# Altium schematic sheet AUDIO.SchDoc
size A4
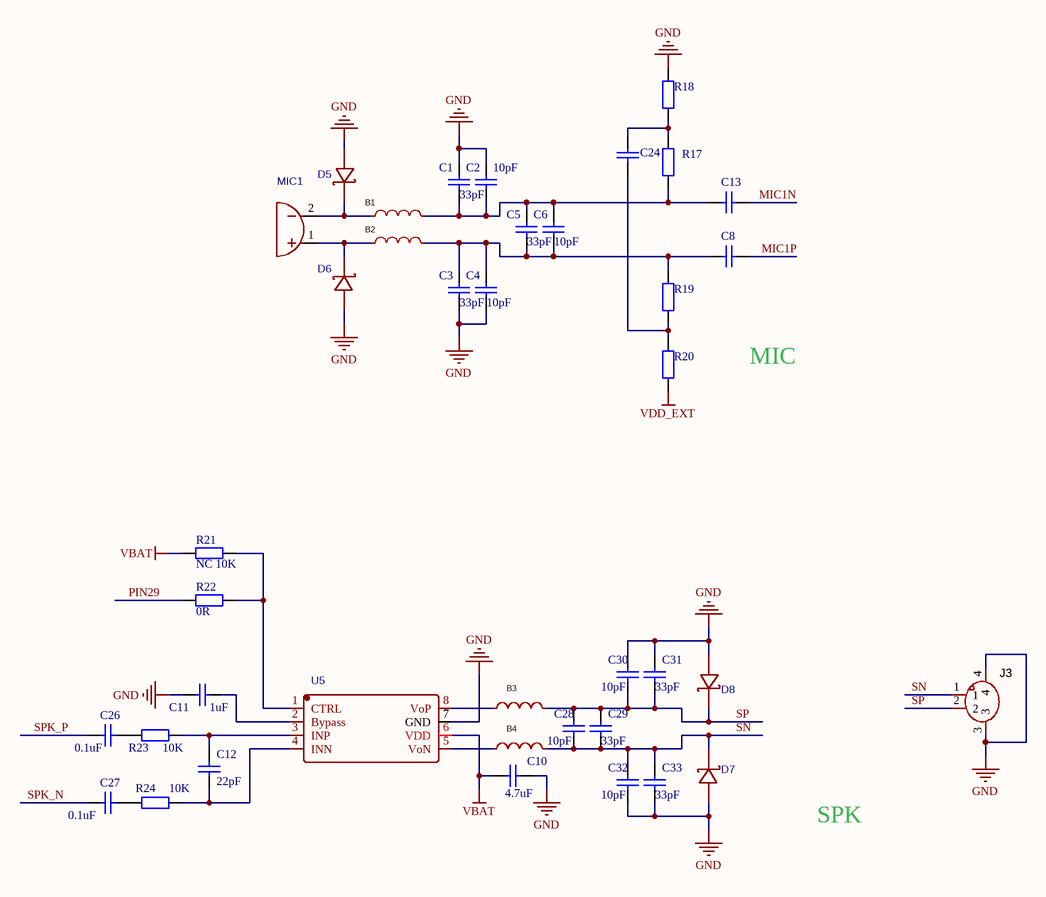
[diagram p0: AUDIO.SchDoc]

## Parts
B1  PZ1005U121-1R0TF  [0402R]  (value not drawn)
B2  PZ1005U121-1R0TF  [0402R]  (value not drawn)
B3  PZ1005U121-1R0TF  [0402R]  (value not drawn)
B4  PZ1005U121-1R0TF  [0402R]  (value not drawn)
C1  value 33pF  [0402C]  (hidden comment: 22pF)
C2  10pF  [0402C]
C3  value 33pF  [0402C]  (hidden comment: 22pF)
C4  10pF  [0402C]
C5  value 33pF  [0402C]  (hidden comment: 22pF)
C6  10pF  [0402C]
C8  0.1uF  [0402C]  (value not drawn)
C10  4.7uF  [0402C]
C11  1uF  [0402C]
C12  22pF  [0402C]
C13  0.1uF  [0402C]  (value not drawn)
C24  10uF  [0402C]  (value not drawn)
C26  0.1uF  [0402C]
C27  0.1uF  [0402C]
C28  10pF  [0402C]
C29  value 33pF  [0402C]  (hidden comment: 22pF)
C30  10pF  [0402C]
C31  value 33pF  [0402C]  (hidden comment: 22pF)
C32  10pF  [0402C]
C33  value 33pF  [0402C]  (hidden comment: 22pF)
D5  LESD8LL5.0T5G  [SOD-882_L1.0-W0.6-RD]  (value not drawn)
D6  LESD8LL5.0T5G  [SOD-882_L1.0-W0.6-RD]  (value not drawn)
D7  LESD8LL5.0T5G  [SOD-882_L1.0-W0.6-RD]  (value not drawn)
D8  LESD8LL5.0T5G  [SOD-882_L1.0-W0.6-RD]  (value not drawn)
J3  WAFER-MX1.25-2PWB  [CONN-SMD_2P-P1.25_XUNPU_WAFER-MX1.25-2PWB]  (value not drawn)
MIC1  B4013AM423-092  [MIC-SMD_BD4.0_B4013AM423-008]  (value not drawn)
R17  1.5K  [0402R]  (value not drawn)
R18  1K  [0402R]  (value not drawn)
R19  1.5K  [0402R]  (value not drawn)
R20  1K  [0402R]  (value not drawn)
R21  NC 10K  [0402R]
R22  0R  [0402R]
R23  10K  [0402R]
R24  10K  [0402R]
U5  NS4150C  [SOIC-8_150mil_NS4150C]  (value not drawn)

## Nets
GND: C1.2 C2.2 C3.1 C4.1 C10.2 C11.1 C30.2 C31.2 C32.1 C33.1 D5.2(A) D6.2(A) D7.2(A) D8.2(A) J3.3 J3.4 R18.2 U5.7(GND)
VBAT: C10.1 R21.2 U5.6(VDD)
VDD_EXT: R20.1
MIC1N: C13.1
MIC1P: C8.1
PIN29: R22.1
SN: B4.2 C28.1 C29.1 C32.2 C33.2 D7.1(C) J3.1
SP: B3.2 C28.2 C29.2 C30.1 C31.1 D8.1(C) J3.2
SPK_N: C27.1
SPK_P: C26.1
NetB1_1: B1.1 D5.1(C) MIC1.2
NetB1_2: B1.2 C1.1 C2.1 C5.2 C6.2 C13.2 R17.1
NetB2_1: B2.1 D6.1(C) MIC1.1
NetB2_2: B2.2 C3.2 C4.2 C5.1 C6.1 C8.2 R19.2
NetB3_1: B3.1 U5.8(VoP)
NetB4_1: B4.1 U5.5(VoN)
NetC11_2: C11.2 U5.2(Bypass)
NetC12_1: C12.1 R23.2 U5.3(INP)
NetC12_2: C12.2 R24.2 U5.4(INN)
NetC24_1: C24.1 R17.2 R18.1
NetC24_2: C24.2 R19.1 R20.2
NetC26_2: C26.2 R23.1
NetC27_2: C27.2 R24.1
NetR21_1: R21.1 R22.2 U5.1(CTRL)

## Notes on the sheet
- MIC
- SPK

## Library data of the parts
B1-B4 = PZ1005U121-1R0TF: 磁珠; Manufacturer: Sunlord(顺络); Add into BOM: yes; Impedance @ Frequency: 120Ω@100MHz; Tolerance: ±25%; DC Resistance: 120mΩ; Current Rating: 1A; Circuits: 1; Symbol: PZ1005U121-1R0TF; Device: PZ1005U121-1R0TF; LCSC Part Name: 单路 0402磁珠 阻抗120Ω@100MHz; Supplier Part: C96723; Manufacturer Part: PZ1005U121-1R0TF; Supplier Footprint: 0402; JLCPCB Part Class: Extended Part; Datasheet: https://atta.szlcsc.com/upload/public/pdf/source/20241120/56CFDC78F74CEDC225A629A43232883A.pdf; Supplier: LCSC; Convert to PCB: yes
C1 C3 C5 C8 C11-C13 C24 C26 C27 C29 C31 C33 = Cap: Capacitor; Published: 8-Jun-2000; LatestRevisionDate: 17-Jul-2002; LatestRevisionNote: Re-released for DXP Platform.; PackageReference: RAD-0.3; Publisher: Altium Limited
C2 C4 C6 C28 C30 C32 = Cap: Capacitor; Value: 33pF; Published: 8-Jun-2000; LatestRevisionDate: 17-Jul-2002; LatestRevisionNote: Re-released for DXP Platform.; PackageReference: RAD-0.3; Publisher: Altium Limited
C10 = Cap: Capacitor; Value: 0.1uF; Published: 8-Jun-2000; LatestRevisionDate: 17-Jul-2002; LatestRevisionNote: Re-released for DXP Platform.; PackageReference: RAD-0.3; Publisher: Altium Limited
D5-D8 = LESD8LL5.0T5G: ESD; BOM_Manufacturer: LRC; Contributor: LCSC; BOM_Supplier Part: C172423; BOM_Supplier: LCSC; BOM_Manufacturer Part: LESD8LL5.0T5G; BOM_JLCPCB Part Class: Extended Part; spicePre: D; spiceSymbolName: LESD8LL5.0T5G
J3 = WAFER-MX1.25-2PWB: WAFER; Manufacturer: XUNPU(讯普); Add into BOM: yes; Pins Structure: 1x2P; Pitch: 1.25mm; Reference Series: PicoBlade(MX 1.25); Number of PINs Per Row: 2; Current Rating: 1A; Voltage Rating: 125V; Plastic Material: LCP; Supplementary Features: 辅助焊脚; Z-Height of the Board: 3.6mm; X-Length of Bottom Edge on Board (Spacing Line): 7.5mm; Y-Width of Bottom Edge on Board: 5.25mm; Symbol: WAFER-MX1.25-2PWB; Device: WAFER-MX1.25-2PWB; LCSC Part Name: 1x2P 间距:1.25mm 卧贴 系列:PicoBlade(MX 1.25); Supplier Part: C3029359; Manufacturer Part: WAFER-MX1.25-2PWB; Supplier Footprint: SMD,P=1.25mm,卧贴; JLCPCB Part Class: Extended Part; Datasheet: https://atta.szlcsc.com/upload/public/pdf/source/20220527/5ACBB683E384B6AD06743F272F933620.pdf; Supplier: LCSC; Convert to PCB: yes; Mounting Type: 卧贴; Number of Pins: 2P; Number of Rows: 1; Row Spacing: -; Contact Material: 黄铜; Contact Plating: -; Operating Temperature: -25℃~+85℃; Flame Retardant Rating: -; Color: 米色
MIC1 = GMI6050P-66DB: MIC; BOM_Manufacturer: Goertek(歌尔); Contributor: LCSC; BOM_Supplier: LCSC; BOM_Supplier Part: C5160218; BOM_Manufacturer Part: B4013AM423-092; spicePre: M; spiceSymbolName: B4013AM423-092
R17-R24 = Res2: Resistor; Published: 8-Jun-2000; LatestRevisionDate: 17-Jul-2002; LatestRevisionNote: Re-released for DXP Platform.; PackageReference: AXIAL-0.4; Publisher: Altium Limited
U5 = NS4160: Amplifier; BOM_Manufacturer: Shenzhen Nsiway Tech; Contributor: LCSC; BOM_Paste Type: expand; BOM_Assembly Type: smtWeld; BOM_Supplier: LCSC; BOM_Supplier Part: C219017; BOM_Manufacturer Part: NS4160; spicePre: U; spiceSymbolName: NS4160